# EAGLE design zesilovac (EAGLE 7.2.0)
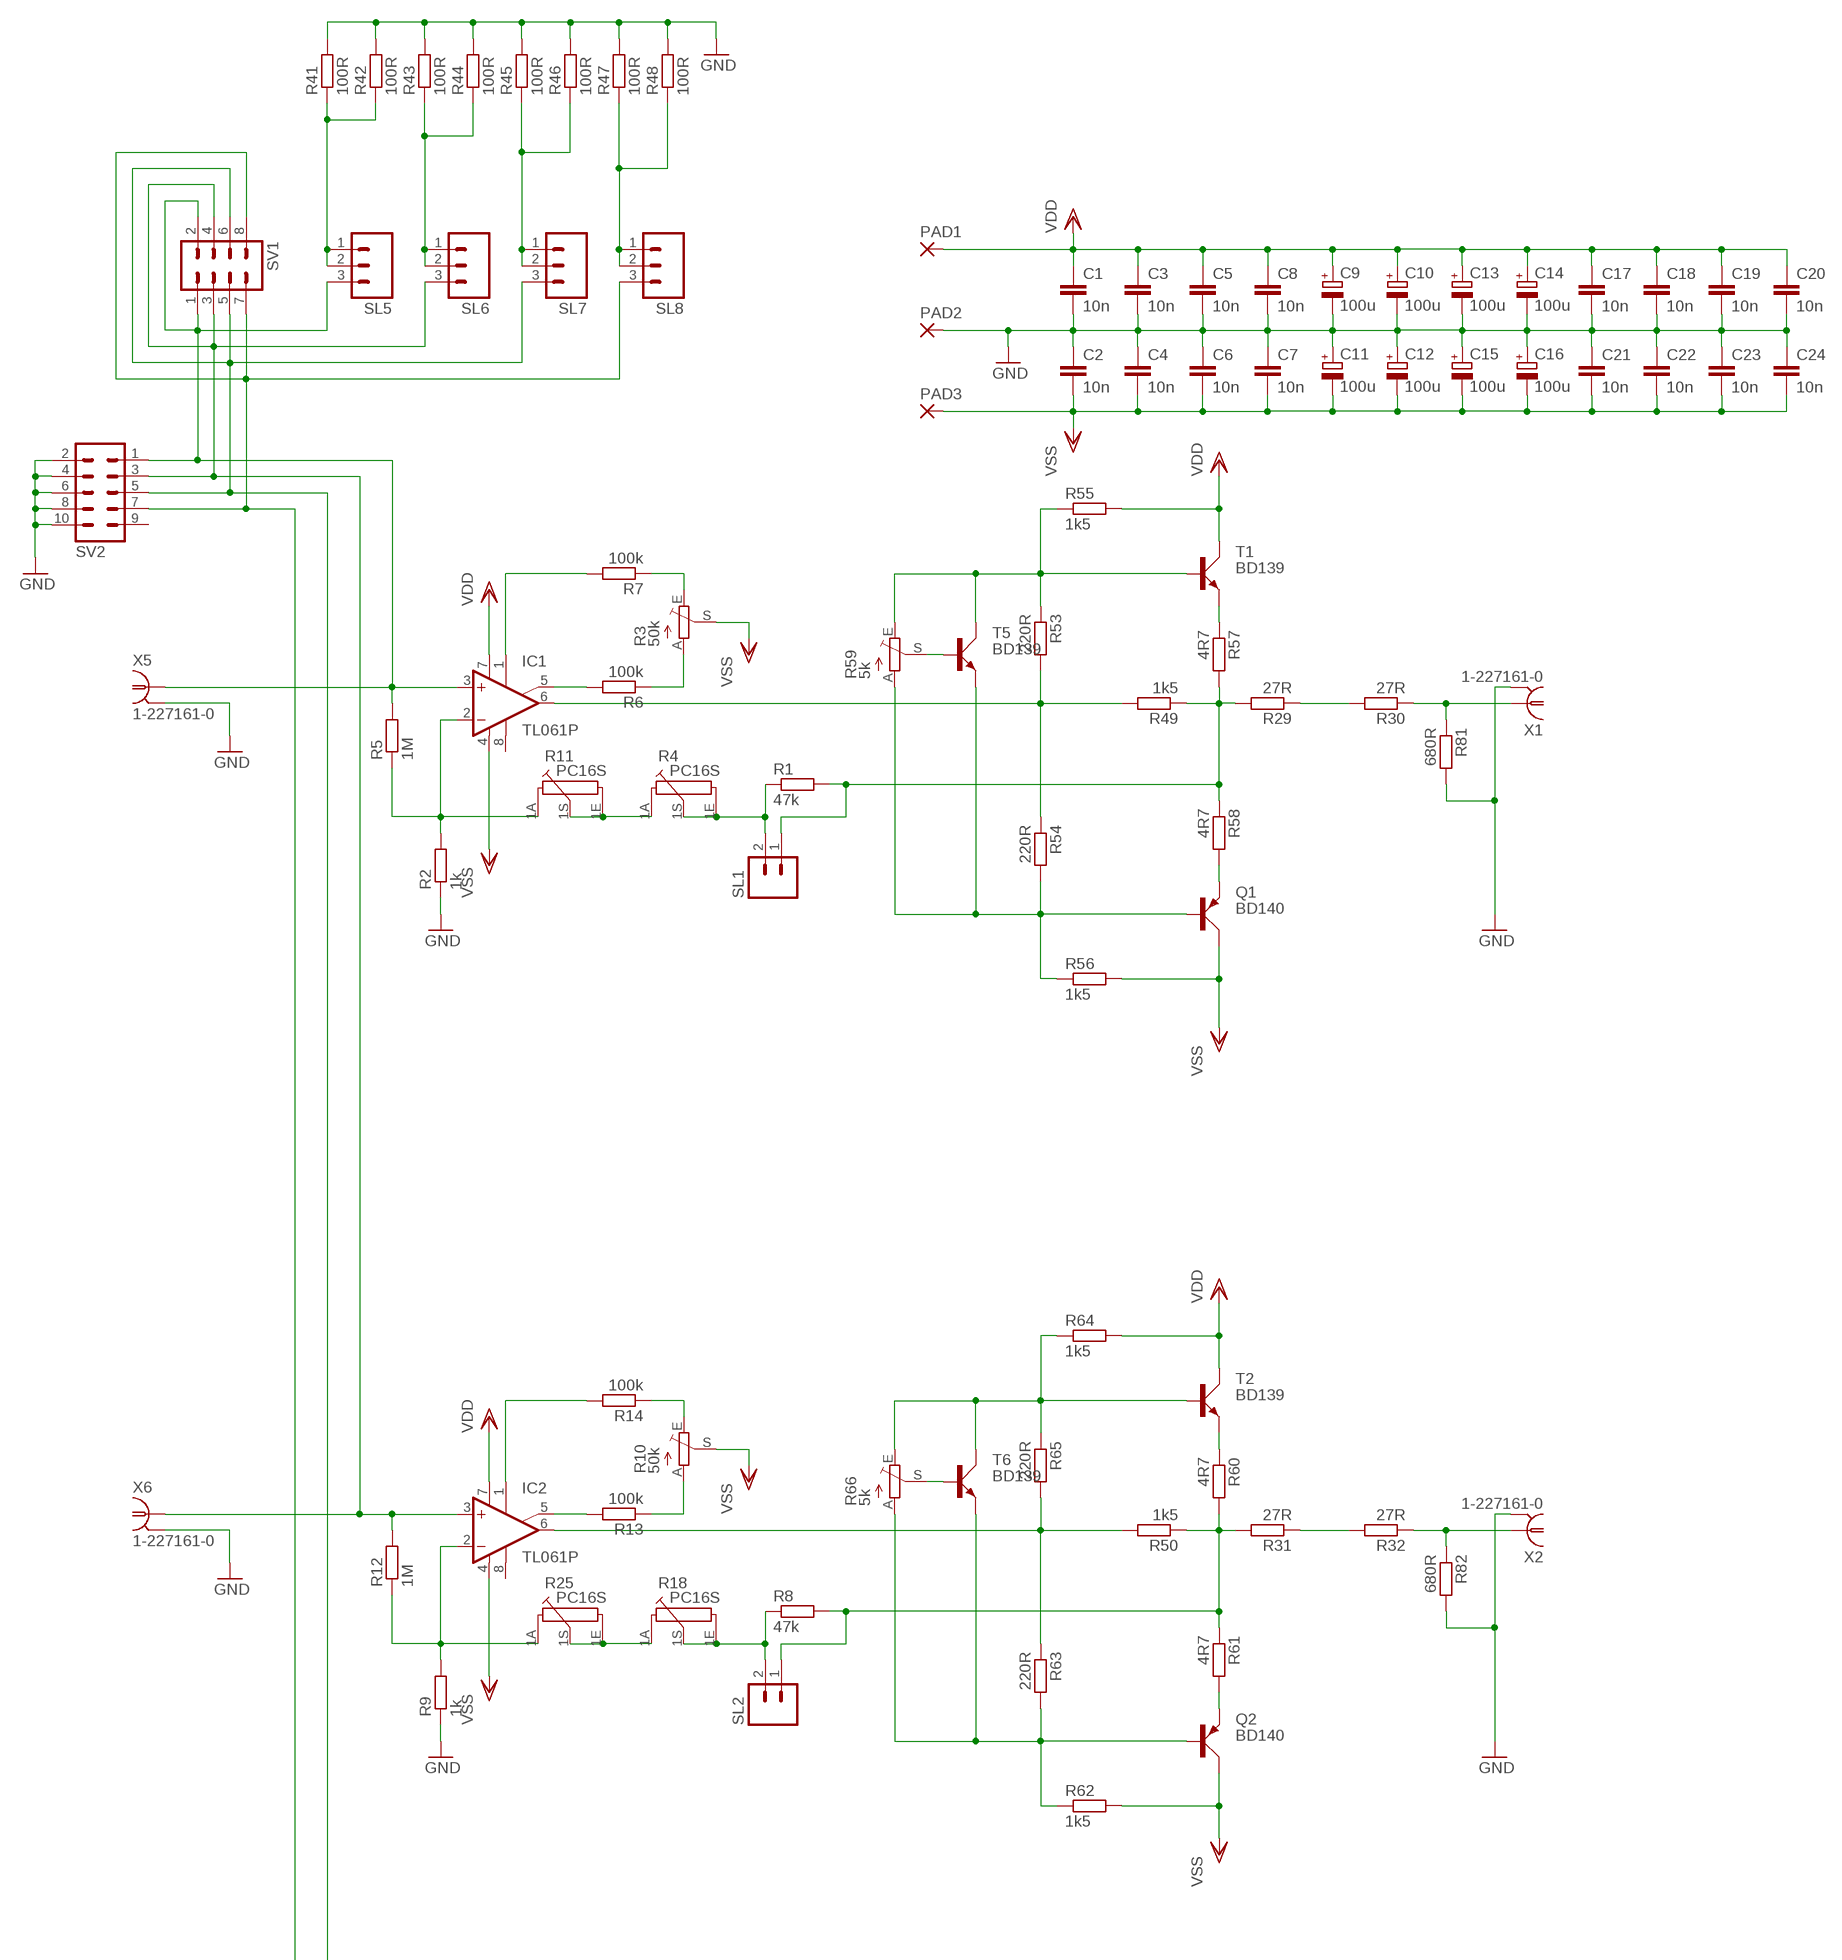
[diagram p0: schematic, sheet 1, part 1 of 2]
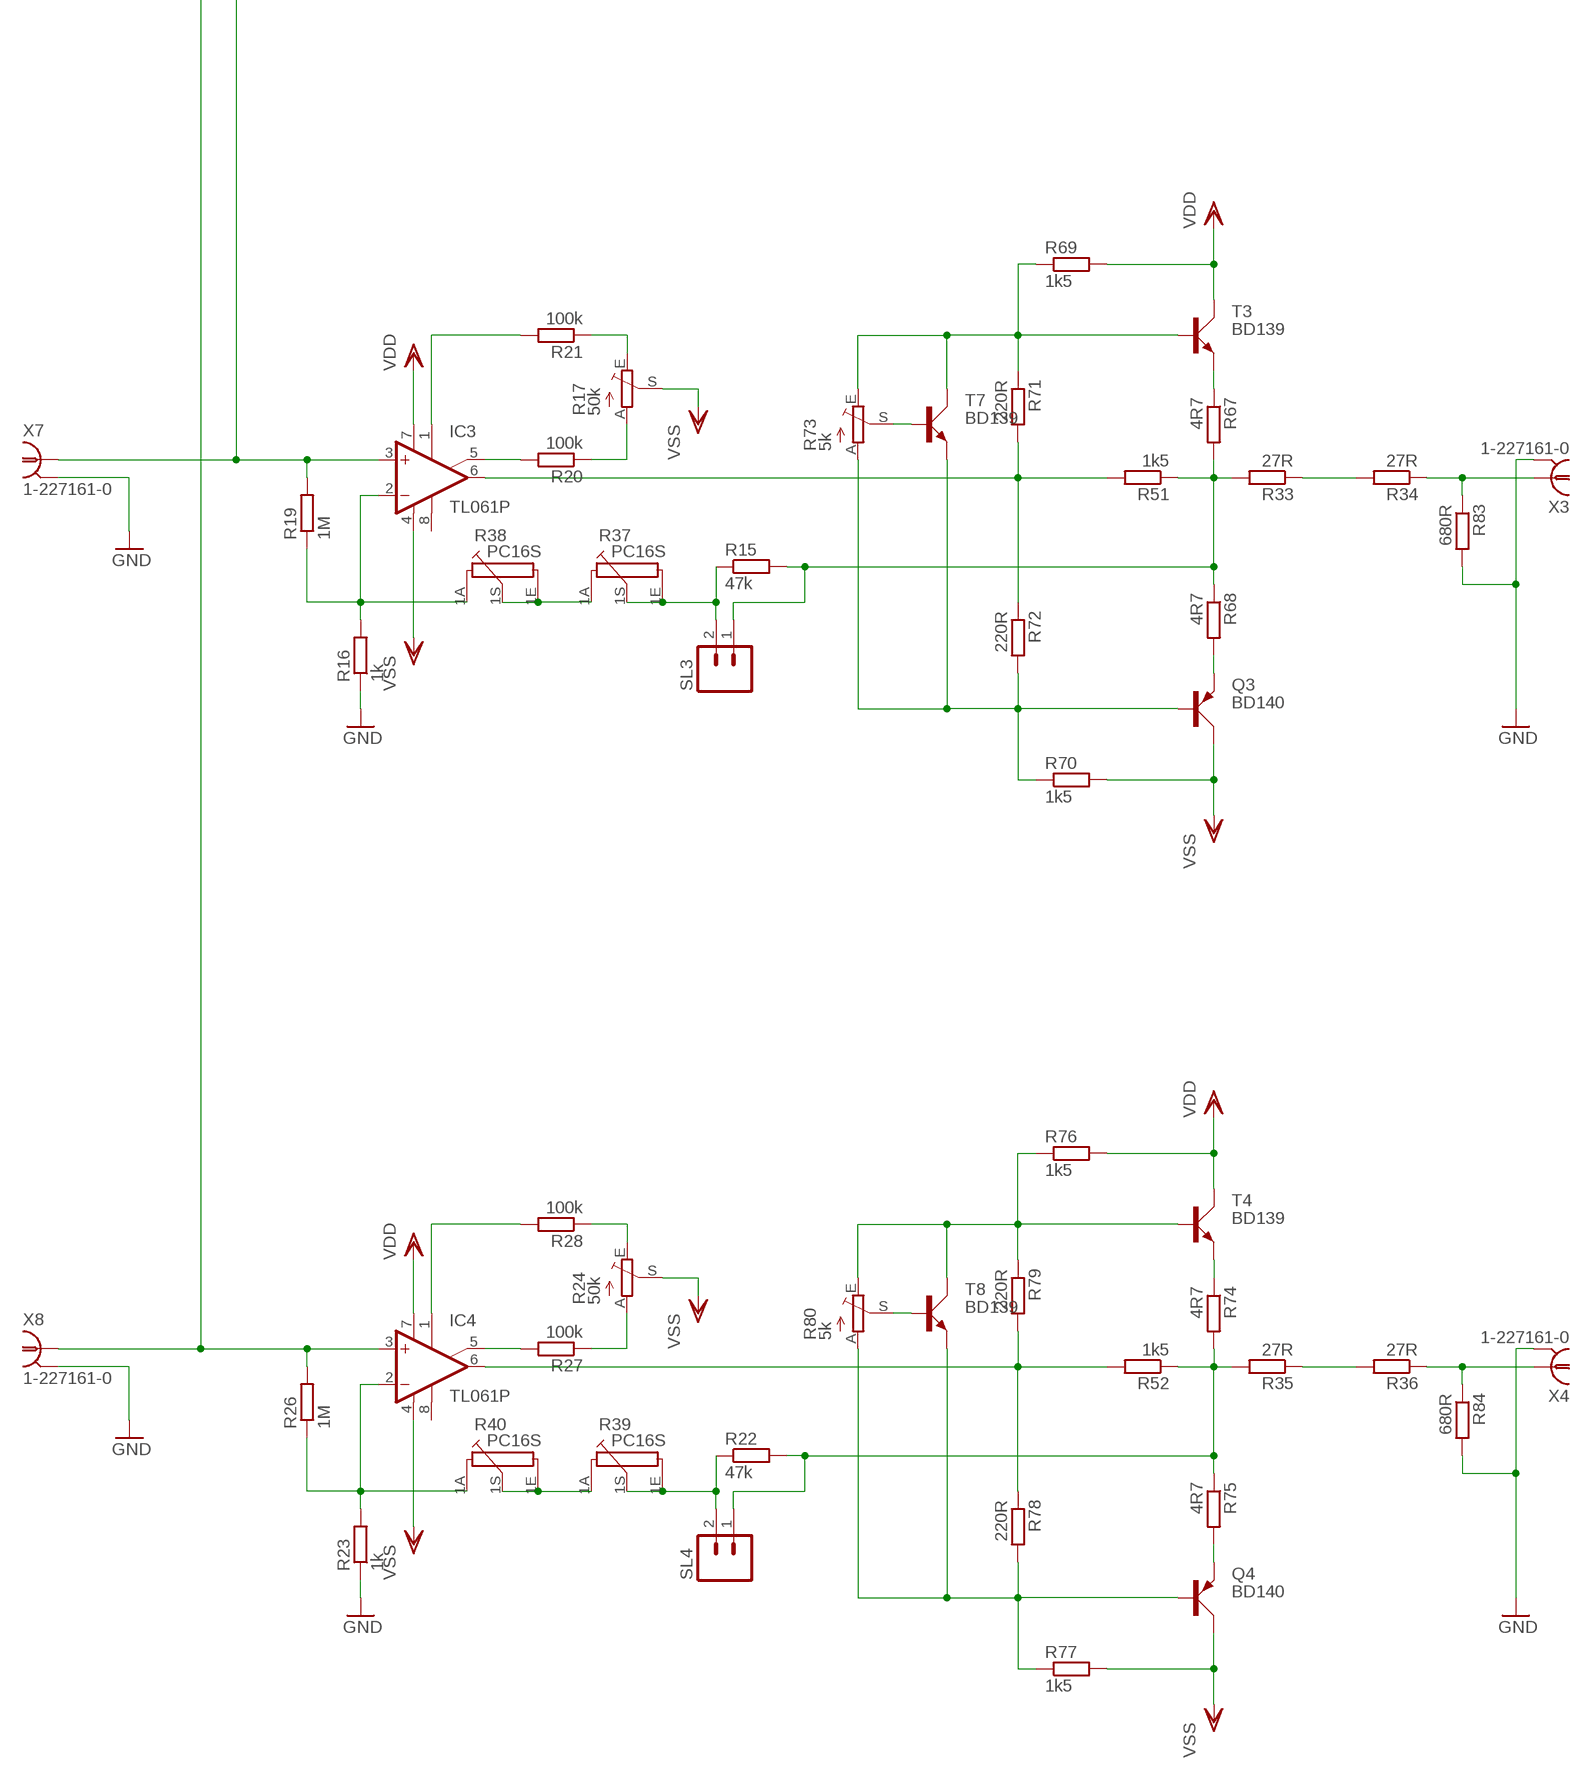
[diagram p1: schematic, sheet 1, part 2 of 2]

## Parts
C1  10n  C5/5  [C5B5]
C2  10n  C5/5  [C5B5]
C3  10n  C5/5  [C5B5]
C4  10n  C5/5  [C5B5]
C5  10n  C5/5  [C5B5]
C6  10n  C5/5  [C5B5]
C7  10n  C5/5  [C5B5]
C8  10n  C5/5  [C5B5]
C9  100u  CPOL-EUE5-13  [E5-13]
C10  100u  CPOL-EUE5-13  [E5-13]
C11  100u  CPOL-EUE5-13  [E5-13]
C12  100u  CPOL-EUE5-13  [E5-13]
C13  100u  CPOL-EUE5-13  [E5-13]
C14  100u  CPOL-EUE5-13  [E5-13]
C15  100u  CPOL-EUE5-13  [E5-13]
C16  100u  CPOL-EUE5-13  [E5-13]
C17  10n  C5/5  [C5B5]
C18  10n  C5/5  [C5B5]
C19  10n  C5/5  [C5B5]
C20  10n  C5/5  [C5B5]
C21  10n  C5/5  [C5B5]
C22  10n  C5/5  [C5B5]
C23  10n  C5/5  [C5B5]
C24  10n  C5/5  [C5B5]
IC1  TL061P  [DIL08]
IC2  TL061P  [DIL08]
IC3  TL061P  [DIL08]
IC4  TL061P  [DIL08]
PAD1  3,81/1,4  [3,81/1,4]
PAD2  3,81/1,4  [3,81/1,4]
PAD3  3,81/1,4  [3,81/1,4]
Q1  BD140  [TO126AV]
Q2  BD140  [TO126AV]
Q3  BD140  [TO126AV]
Q4  BD140  [TO126AV]
R1  47k  R-EU_0207/12  [0207/12]
R2  1k  R-EU_0207/12  [0207/12]
R3  50k  TRIM_EU-LI10  [LI10]
R4  PC16S  [PC16S]
R5  1M  R-EU_0207/12  [0207/12]
R6  100k  R-EU_0207/12  [0207/12]
R7  100k  R-EU_0207/12  [0207/12]
R8  47k  R-EU_0207/12  [0207/12]
R9  1k  R-EU_0207/12  [0207/12]
R10  50k  TRIM_EU-LI10  [LI10]
R11  PC16S  [PC16S]
R12  1M  R-EU_0207/12  [0207/12]
R13  100k  R-EU_0207/12  [0207/12]
R14  100k  R-EU_0207/12  [0207/12]
R15  47k  R-EU_0207/12  [0207/12]
R16  1k  R-EU_0207/12  [0207/12]
R17  50k  TRIM_EU-LI10  [LI10]
R18  PC16S  [PC16S]
R19  1M  R-EU_0207/12  [0207/12]
R20  100k  R-EU_0207/12  [0207/12]
R21  100k  R-EU_0207/12  [0207/12]
R22  47k  R-EU_0207/12  [0207/12]
R23  1k  R-EU_0207/12  [0207/12]
R24  50k  TRIM_EU-LI10  [LI10]
R25  PC16S  [PC16S]
R26  1M  R-EU_0207/12  [0207/12]
R27  100k  R-EU_0207/12  [0207/12]
R28  100k  R-EU_0207/12  [0207/12]
R29  27R  R-EU_0411/12  [0411/12]
R30  27R  R-EU_0411/12  [0411/12]
R31  27R  R-EU_0411/12  [0411/12]
R32  27R  R-EU_0411/12  [0411/12]
R33  27R  R-EU_0411/12  [0411/12]
R34  27R  R-EU_0411/12  [0411/12]
R35  27R  R-EU_0411/12  [0411/12]
R36  27R  R-EU_0411/12  [0411/12]
R37  PC16S  [PC16S]
R38  PC16S  [PC16S]
R39  PC16S  [PC16S]
R40  PC16S  [PC16S]
R41  100R  R-EU_0207/12  [0207/12]
R42  100R  R-EU_0207/12  [0207/12]
R43  100R  R-EU_0207/12  [0207/12]
R44  100R  R-EU_0207/12  [0207/12]
R45  100R  R-EU_0207/12  [0207/12]
R46  100R  R-EU_0207/12  [0207/12]
R47  100R  R-EU_0207/12  [0207/12]
R48  100R  R-EU_0207/12  [0207/12]
R49  1k5  R-EU_0207/12  [0207/12]
R50  1k5  R-EU_0207/12  [0207/12]
R51  1k5  R-EU_0207/12  [0207/12]
R52  1k5  R-EU_0207/12  [0207/12]
R53  220R  R-EU_0207/12  [0207/12]
R54  220R  R-EU_0207/12  [0207/12]
R55  1k5  R-EU_0207/12  [0207/12]
R56  1k5  R-EU_0207/12  [0207/12]
R57  4R7  R-EU_0207/12  [0207/12]
R58  4R7  R-EU_0207/12  [0207/12]
R59  5k  TRIM_EU-LI10  [LI10]
R60  4R7  R-EU_0207/12  [0207/12]
R61  4R7  R-EU_0207/12  [0207/12]
R62  1k5  R-EU_0207/12  [0207/12]
R63  220R  R-EU_0207/12  [0207/12]
R64  1k5  R-EU_0207/12  [0207/12]
R65  220R  R-EU_0207/12  [0207/12]
R66  5k  TRIM_EU-LI10  [LI10]
R67  4R7  R-EU_0207/12  [0207/12]
R68  4R7  R-EU_0207/12  [0207/12]
R69  1k5  R-EU_0207/12  [0207/12]
R70  1k5  R-EU_0207/12  [0207/12]
R71  220R  R-EU_0207/12  [0207/12]
R72  220R  R-EU_0207/12  [0207/12]
R73  5k  TRIM_EU-LI10  [LI10]
R74  4R7  R-EU_0207/12  [0207/12]
R75  4R7  R-EU_0207/12  [0207/12]
R76  1k5  R-EU_0207/12  [0207/12]
R77  1k5  R-EU_0207/12  [0207/12]
R78  220R  R-EU_0207/12  [0207/12]
R79  220R  R-EU_0207/12  [0207/12]
R80  5k  TRIM_EU-LI10  [LI10]
R81  680R  R-EU_0207/12  [0207/12]
R82  680R  R-EU_0207/12  [0207/12]
R83  680R  R-EU_0207/12  [0207/12]
R84  680R  R-EU_0207/12  [0207/12]
SL1  M02  [02P]
SL2  M02  [02P]
SL3  M02  [02P]
SL4  M02  [02P]
SL5  M03  [03P]
SL6  M03  [03P]
SL7  M03  [03P]
SL8  M03  [03P]
SV1  MA04-2  [MA04-2]
SV2  MA05-2  [MA05-2]
T1  BD139  [TO126AV]
T2  BD139  [TO126AV]
T3  BD139  [TO126AV]
T4  BD139  [TO126AV]
T5  BD139  [TO126AV]
T6  BD139  [TO126AV]
T7  BD139  [TO126AV]
T8  BD139  [TO126AV]
X1  1-227161-0  [AMP_227161]
X2  1-227161-0  [AMP_227161]
X3  1-227161-0  [AMP_227161]
X4  1-227161-0  [AMP_227161]
X5  1-227161-0  [AMP_227161]
X6  1-227161-0  [AMP_227161]
X7  1-227161-0  [AMP_227161]
X8  1-227161-0  [AMP_227161]

## Nets
GND: C1.2 C2.1 C3.2 C4.1 C5.2 C6.1 C7.1 C8.2 C9.- C10.- C11.+ C12.+ C13.- C14.- C15.+ C16.+ C17.2 C18.2 C19.2 C20.2 C21.1 C22.1 C23.1 C24.1 PAD2.1(P) R2.1 R9.1 R16.1 R23.1 R41.2 R42.2 R43.2 R44.2 R45.2 R46.2 R47.2 R48.2 R81.2 R82.2 R83.2 R84.2 SV2.2 SV2.4 SV2.6 SV2.8 SV2.10 X1.2 X2.2 X3.2 X4.2 X5.2 X6.2 X7.2 X8.2
N$1: IC1.2(-IN) R2.2 R5.1 R11.1A
N$2: R1.1 R4.1E R4.1S SL1.2
N$3: IC1.6(OUT) R49.2 R53.2 R54.1
N$4: IC1.1(ON1) R7.2
N$5: R3.A R6.1
N$6: IC1.3(+IN) R5.2 SL5.3 SV1.1 SV1.2 SV2.1 X5.1
N$7: R3.E R7.1
N$8: IC1.5(ON2) R6.2
N$9: IC2.2(-IN) R9.2 R12.1 R25.1A
N$10: R22.2 R35.2 R52.1 R74.2 R75.1 SL4.1
N$11: IC2.1(ON1) R14.2
N$12: R10.A R13.1
N$13: R4.1A R11.1E R11.1S
N$14: IC2.3(+IN) R12.2 SL6.3 SV1.3 SV1.4 SV2.3 X6.1
N$15: R10.E R14.1
N$16: IC2.5(ON2) R13.2
N$17: IC3.2(-IN) R16.2 R19.1 R38.1A
N$18: R15.2 R33.2 R51.1 R67.2 R68.1 SL3.1
N$19: IC3.1(ON1) R21.2
N$20: R17.A R20.1
N$21: R15.1 R37.1E R37.1S SL3.2
N$22: IC3.3(+IN) R19.2 SL7.3 SV1.5 SV1.6 SV2.5 X7.1
N$23: R17.E R21.1
N$24: IC3.5(ON2) R20.2
N$25: IC4.2(-IN) R23.2 R26.1 R40.1A
N$26: R8.2 R31.2 R50.1 R60.2 R61.1 SL2.1
N$27: IC4.1(ON1) R28.2
N$28: R24.A R27.1
N$29: R22.1 R39.1E R39.1S SL4.2
N$30: IC4.3(+IN) R26.2 SL8.3 SV1.7 SV1.8 SV2.7 X8.1
N$31: R24.E R28.1
N$32: IC4.5(ON2) R27.2
N$33: R8.1 R18.1E R18.1S SL2.2
N$34: R18.1A R25.1E R25.1S
N$35: R37.1A R38.1E R38.1S
N$36: R29.1 R30.2
N$37: R31.1 R32.2
N$38: R35.1 R36.2
N$39: R36.1 R84.1 X4.1
N$40: R39.1A R40.1E R40.1S
N$41: Q1.B R54.2 R56.1 R59.A T5.E
N$42: R43.1 R44.1 SL6.1 SL6.2
N$43: R45.1 R46.1 SL7.1 SL7.2
N$44: R47.1 R48.1 SL8.1 SL8.2
N$45: IC2.6(OUT) R50.2 R63.1 R65.2
N$46: R1.2 R29.2 R49.1 R57.2 R58.1 SL1.1
N$47: R41.1 R42.1 SL5.1 SL5.2
N$48: IC3.6(OUT) R51.2 R71.2 R72.1
N$49: R53.1 R55.1 R59.E T1.B T5.C
N$50: IC4.6(OUT) R52.2 R78.1 R79.2
N$51: R57.1 T1.E
N$52: Q1.E R58.2
N$53: R59.S T5.B
N$54: R67.1 T3.E
N$55: Q2.E R61.2
N$56: Q3.E R68.2
N$57: R60.1 T2.E
N$58: Q2.B R62.1 R63.2 R66.A T6.E
N$59: R64.1 R65.1 R66.E T2.B T6.C
N$60: R66.S T6.B
N$61: R69.1 R71.1 R73.E T3.B T7.C
N$62: Q3.B R70.1 R72.2 R73.A T7.E
N$63: R74.1 T4.E
N$64: Q4.E R75.2
N$65: R73.S T7.B
N$66: R30.1 R81.1 X1.1
N$67: R32.1 R82.1 X2.1
N$68: R76.1 R79.1 R80.E T4.B T8.C
N$69: Q4.B R77.1 R78.2 R80.A T8.E
N$70: R80.S T8.B
N$72: R33.1 R34.2
N$73: R34.1 R83.1 X3.1
VDD: C1.1 C3.1 C5.1 C8.1 C9.+ C10.+ C13.+ C14.+ C17.1 C18.1 C19.1 C20.1 IC1.7(V+) IC2.7(V+) IC3.7(V+) IC4.7(V+) PAD1.1(P) R55.2 R64.2 R69.2 R76.2 T1.C T2.C T3.C T4.C
VSS: C2.2 C4.2 C6.2 C7.2 C11.- C12.- C15.- C16.- C21.2 C22.2 C23.2 C24.2 IC1.4(V-) IC2.4(V-) IC3.4(V-) IC4.4(V-) PAD3.1(P) Q1.C Q2.C Q3.C Q4.C R3.S R10.S R17.S R24.S R56.2 R62.2 R70.2 R77.2
Unconnected: IC1.8(OPT) IC2.8(OPT) IC3.8(OPT) IC4.8(OPT) SV2.9

## Library data of the parts
C1-C8 C17-C24 = capacitor-wima:C: CAPACITOR naming: grid - package width
C9-C16 = rcl:CPOL-EU: POLARIZED CAPACITOR, European symbol
IC1-IC4 = linear:TL061: OP AMP
PAD1-PAD3 = wirepad:3,81/1,4: THROUGH-HOLE PAD
Q1-Q4 = transistor-power:BD140: PNP TRANSISTOR
R1 R2 R5-R9 R12-R16 R19-R23 R26-R36 R41-R58 R60-R65 R67-R72 R74-R79 R81-R84 = resistor:R-EU_: RESISTOR, European symbol
R3 R10 R17 R24 R59 R66 R73 R80 = pot:TRIM_EU-: POTENTIOMETER
R4 R11 R18 R25 R37-R40 = piher:PC16S: POTENTIOMETER single carbon potentiometer, 16 mm, S3ROH; OC_FARNELL: 4452940; OC_NEWARK: unknown
SL1-SL4 = con-amp-quick:M02: AMP QUICK CONNECTOR; OC_FARNELL: unknown; OC_NEWARK: unknown
SL5-SL8 = con-amp-quick:M03: AMP QUICK CONNECTOR; OC_FARNELL: unknown; OC_NEWARK: unknown
SV1 = con-lstb:MA04-2: PIN HEADER; OC_FARNELL: unknown; OC_NEWARK: unknown
SV2 = con-lstb:MA05-2: PIN HEADER; OC_FARNELL: unknown; OC_NEWARK: unknown
T1-T8 = transistor-power:BD139: NPN TRANSISTOR
X1-X8 = con-coax:?227161*: JACK, RIGHT ANGLE, 50 OHM, PCB, BNC Source: amp_227161.pdf; MF: TYCO ELECTRONICS; MPN: 1-227161; OC_FARNELL: unknown; OC_NEWARK: 33B3200

## Board
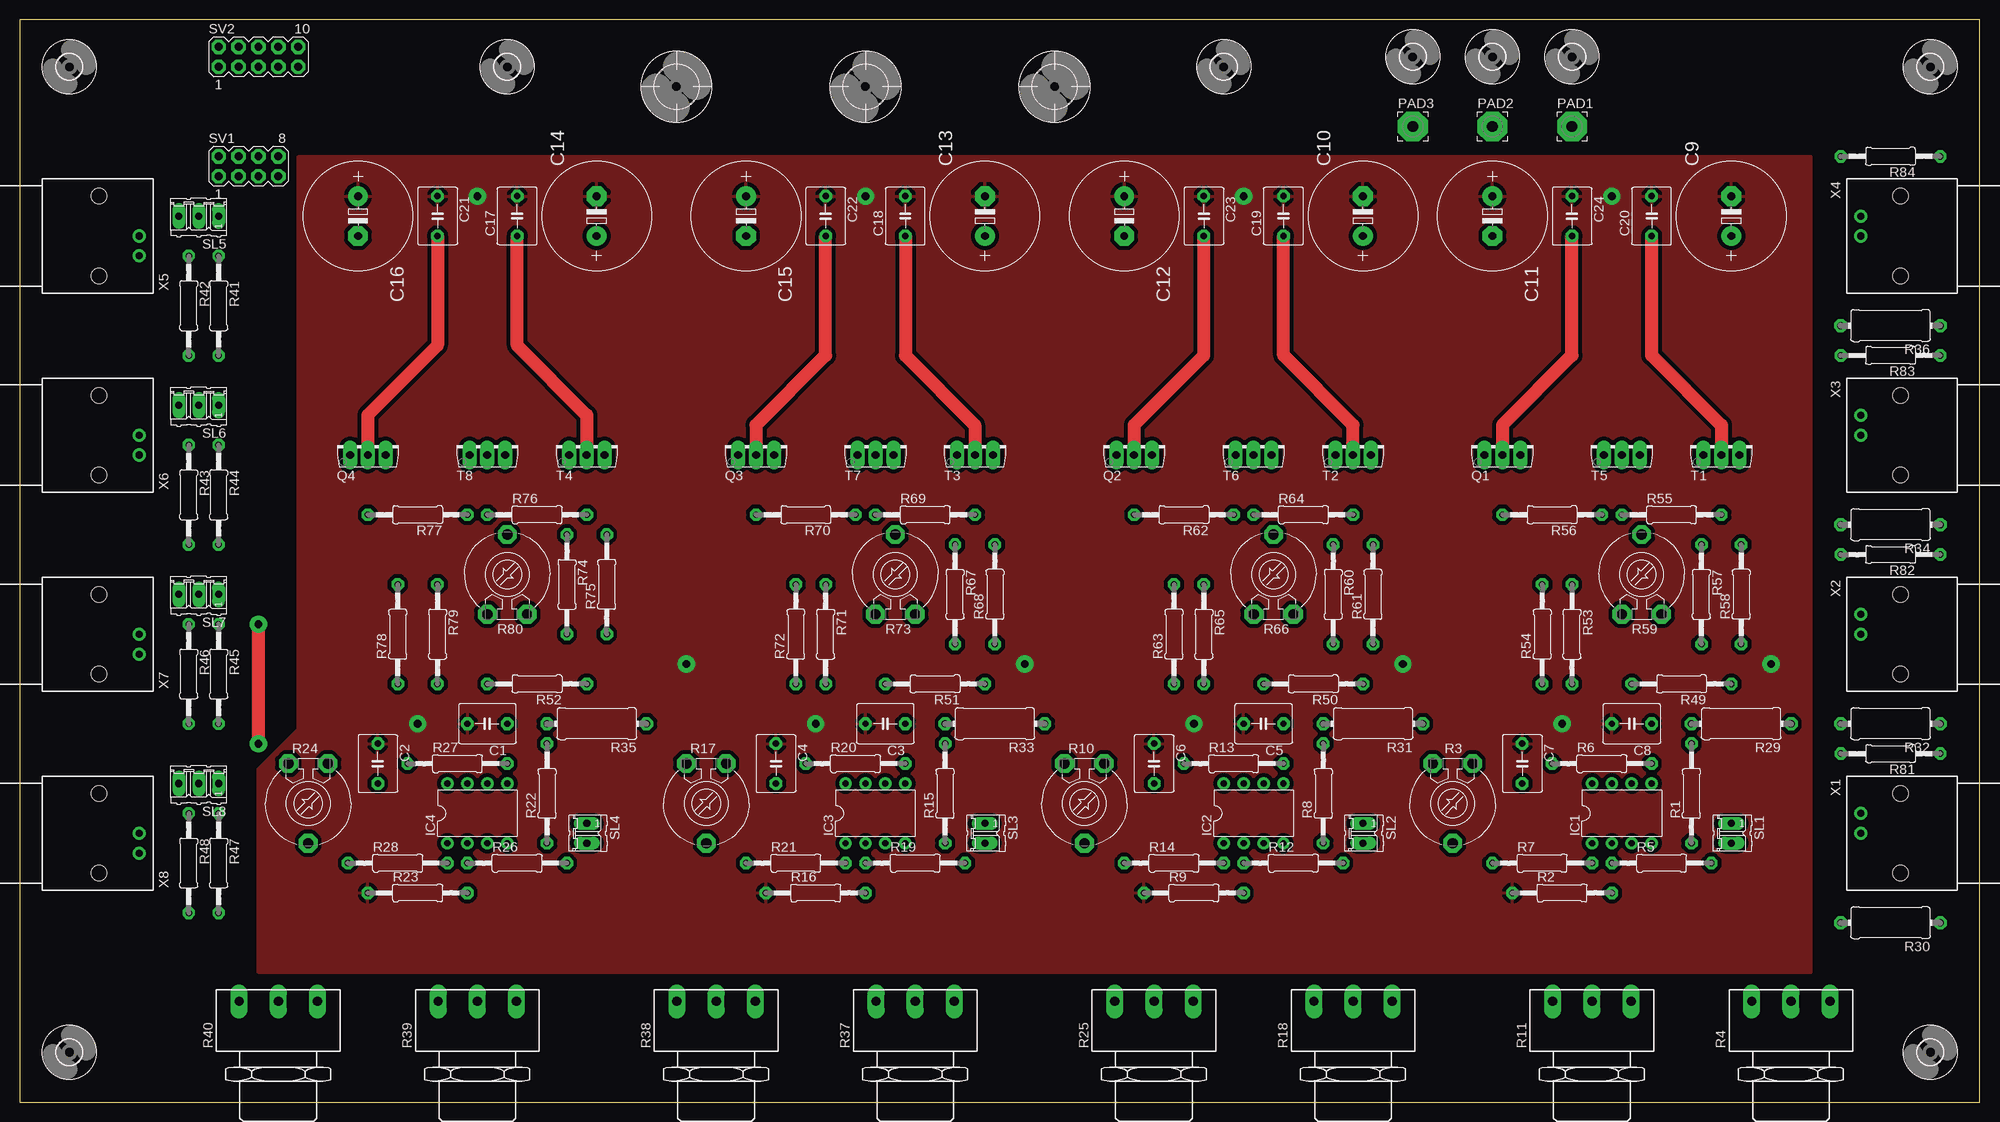
[diagram p2: board, top side]
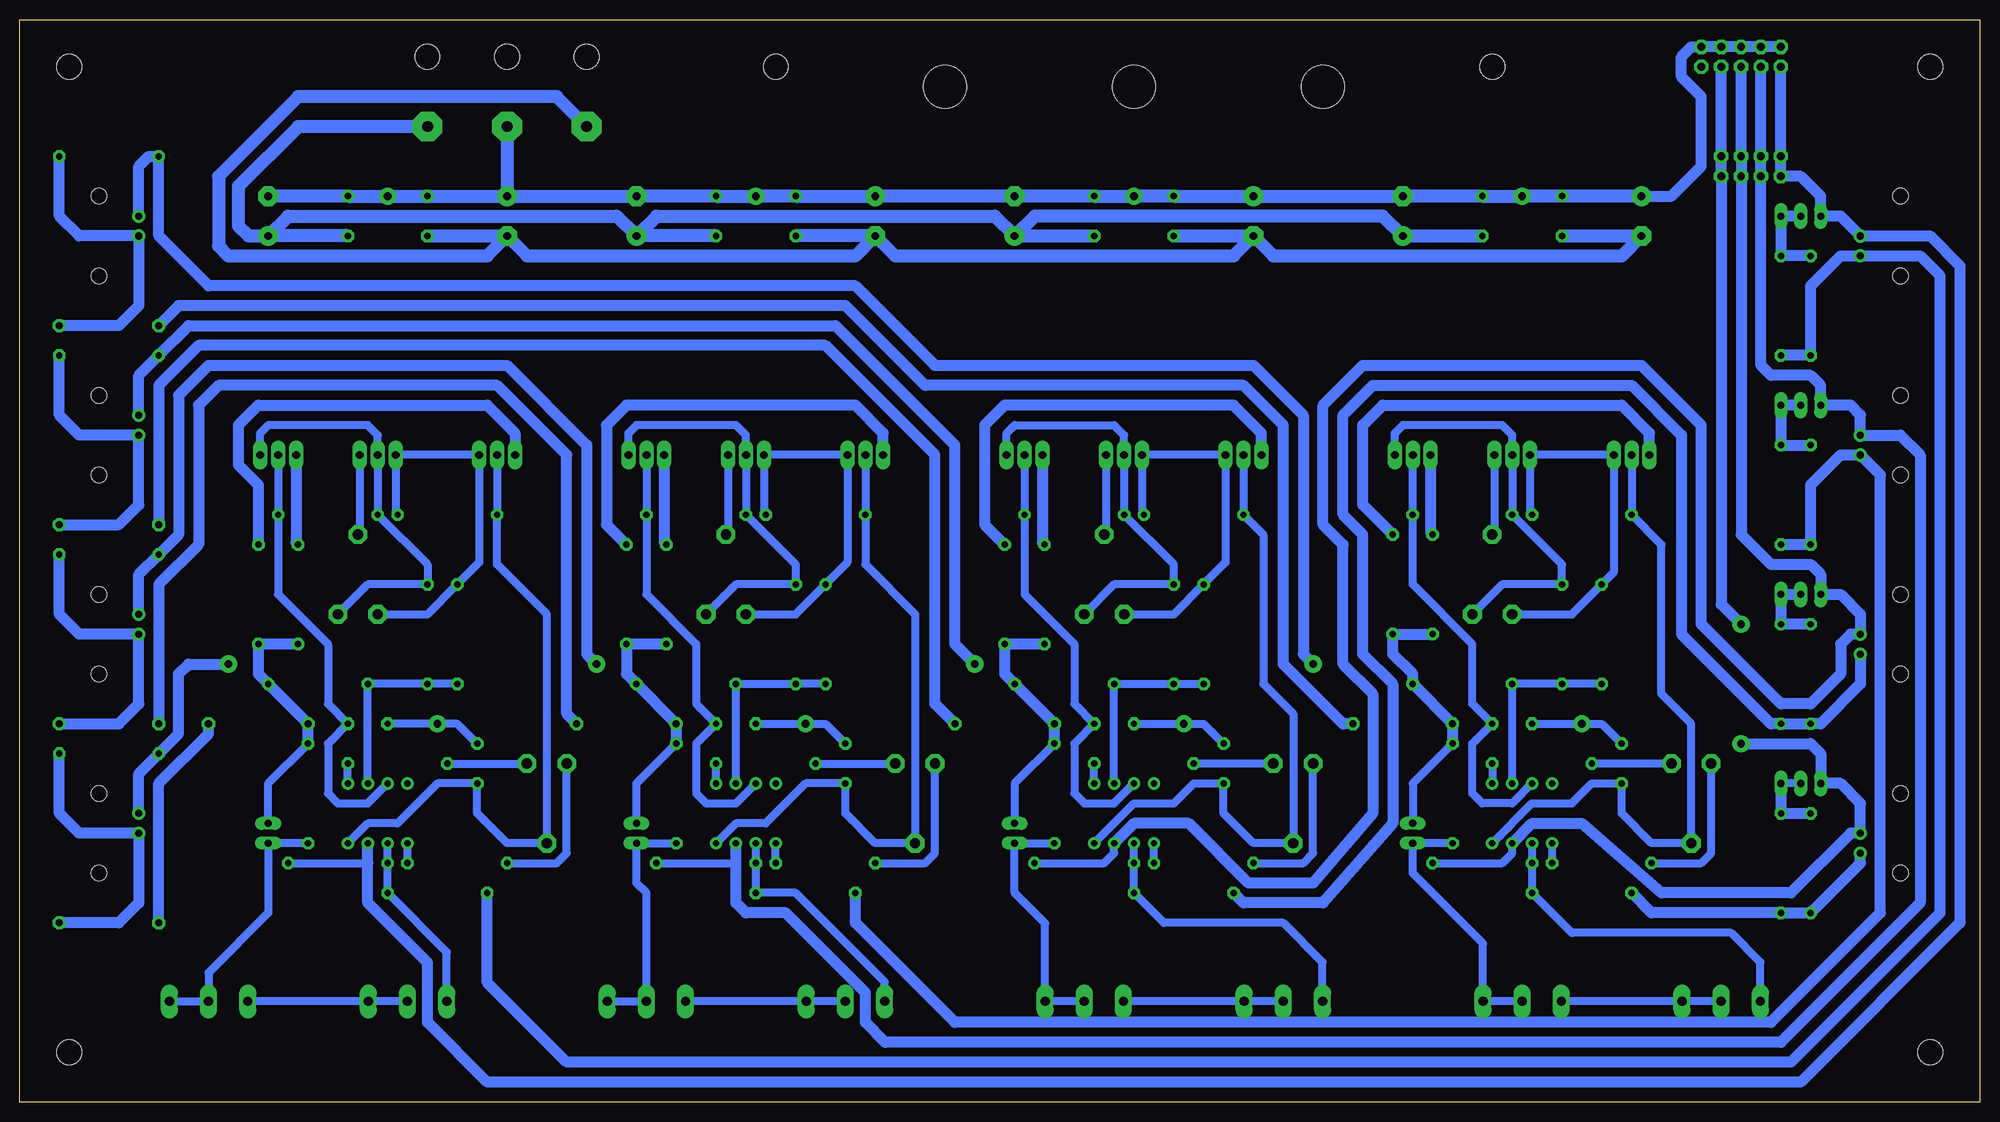
[diagram p3: board, bottom side, seen from below]

Size 250.17 x 138.1 mm. Coordinates in mm from the lower left corner, seen from the top.
Outline: 0,0 250.17,0 250.17,138.1 0,138.1 0,0
Copper layers (1*16): Top 0.035mm / dielectric 1.5mm / Bottom 0.035mm
Design rules "default *": minimum track width 10mil, minimum drill 24mil, track to track 20mil, track to pad 20mil, pad to pad 20mil, via to via 20mil, smd to smd 8mil, copper to edge 40mil, drill to drill 8mil, minimum pad ring 15mil, minimum via ring 8mil, stop-mask expansion 4mil, vias tented up to drill 0mil, thermal gap 20mil

### Footprints (pad centres in the part's own frame; a part is rotated, then mirrored left to right if it is on the bottom)
C5B5 = drill 0.813 pad 1.6 octagon: 1 -2.54,0; 2 2.54,0
E5-13 = drill 1.016 pad 2.54: + -2.54,0 | drill 1.016 pad 2.54 octagon: - 2.54,0
DIL08 = drill 0.813 pad 1.27: 1 -3.81,-3.81; 2 -1.27,-3.81; 3 1.27,-3.81; 4 3.81,-3.81; 5 3.81,3.81; 6 1.27,3.81; 7 -1.27,3.81; 8 -3.81,3.81
3,81/1,4 = drill 1.397 pad 3.81 octagon: 1 0,0
TO126AV = drill 1.016 long: B 2.286,-1.27; C 0,-1.27; E -2.286,-1.27
0207/12 = drill 0.813 octagon: 1 -6.35,0; 2 6.35,0
LI10 = drill 1.321 octagon: A -2.54,-5.08; E 2.54,-5.08; S 0,5.08
PC16S = drill 1.2 long: 1A -5,6.5; 1E 5,6.5; 1S 0,6.5
0411/12 = drill 0.914 octagon: 1 -6.35,0; 2 6.35,0
02P = drill 0.914 long: 1 -1.27,0; 2 1.27,0
03P = drill 0.914 long: 1 -2.54,0; 2 0,0; 3 2.54,0
MA04-2 = drill 1.016 octagon: 1 -3.81,-1.27; 2 -3.81,1.27; 3 -1.27,-1.27; 4 -1.27,1.27; 5 1.27,-1.27; 6 1.27,1.27; 7 3.81,-1.27; 8 3.81,1.27
MA05-2 = drill 1.016 octagon: 1 -5.08,-1.27; 2 -5.08,1.27; 3 -2.54,-1.27; 4 -2.54,1.27; 5 0,-1.27; 6 0,1.27; 7 2.54,-1.27; 8 2.54,1.27; 9 5.08,-1.27; 10 5.08,1.27
3,2 = hole 3.2: 0,0
5,5 = hole 5.5: 0,0
AMP_227161 = drill 0.9 pad 1.27: 1 0,-5.08; 2 -2.54,-5.08 | hole 2: -5.08,0; 5.08,0

### Placement (x,y rotation side)
C1  59.69,48.26 180 top
C2  45.72,43.18 270 top
C3  110.49,48.26 180 top
C4  96.52,43.18 270 top
C5  158.75,48.26 180 top
C6  144.78,43.18 270 top
C7  191.77,43.18 270 top
C8  205.74,48.26 180 top
C9  218.44,113.03 90 top
C10  171.45,113.03 90 top
C11  187.96,113.03 270 top
C12  140.97,113.03 270 top
C13  123.19,113.03 90 top
C14  73.66,113.03 90 top
C15  92.71,113.03 270 top
C16  43.18,113.03 270 top
C17  63.5,113.03 90 top
C18  113.03,113.03 90 top
C19  161.29,113.03 90 top
C20  208.28,113.03 90 top
C21  53.34,113.03 270 top
C22  102.87,113.03 270 top
C23  151.13,113.03 270 top
C24  198.12,113.03 270 top
IC1  204.47,36.83 0 top
IC2  157.48,36.83 0 top
IC3  109.22,36.83 0 top
IC4  58.42,36.83 0 top
PAD1  198.12,124.46 0 top
PAD2  187.96,124.46 0 top
PAD3  177.8,124.46 0 top
Q1  189.23,83.82 0 top
Q2  142.24,83.82 0 top
Q3  93.98,83.82 0 top
Q4  44.45,83.82 0 top
R1  213.36,39.37 90 top
R2  196.85,26.67 0 top
R3  182.88,38.1 180 top
R4  226.06,6.35 0 top
R5  209.55,30.48 0 top
R6  201.93,43.18 0 top
R7  194.31,30.48 0 top
R8  166.37,39.37 90 top
R9  149.86,26.67 0 top
R10  135.89,38.1 180 top
R11  200.66,6.35 0 top
R12  162.56,30.48 0 top
R13  154.94,43.18 0 top
R14  147.32,30.48 0 top
R15  118.11,39.37 90 top
R16  101.6,26.67 0 top
R17  87.63,38.1 180 top
R18  170.18,6.35 0 top
R19  114.3,30.48 0 top
R20  106.68,43.18 0 top
R21  99.06,30.48 0 top
R22  67.31,39.37 90 top
R23  50.8,26.67 0 top
R24  36.83,38.1 180 top
R25  144.78,6.35 0 top
R26  63.5,30.48 0 top
R27  55.88,43.18 0 top
R28  48.26,30.48 0 top
R29  219.71,48.26 180 top
R30  238.76,22.86 180 top
R31  172.72,48.26 180 top
R32  238.76,48.26 180 top
R33  124.46,48.26 180 top
R34  238.76,73.66 180 top
R35  73.66,48.26 180 top
R36  238.76,99.06 180 top
R37  114.3,6.35 0 top
R38  88.9,6.35 0 top
R39  58.42,6.35 0 top
R40  33.02,6.35 0 top
R41  25.4,101.6 270 top
R42  21.59,101.6 270 top
R43  21.59,77.47 270 top
R44  25.4,77.47 270 top
R45  25.4,54.61 270 top
R46  21.59,54.61 270 top
R47  25.4,30.48 270 top
R48  21.59,30.48 270 top
R49  212.09,53.34 180 top
R50  165.1,53.34 180 top
R51  116.84,53.34 180 top
R52  66.04,53.34 180 top
R53  198.12,59.69 270 top
R54  194.31,59.69 90 top
R55  210.82,74.93 0 top
R56  195.58,74.93 180 top
R57  214.63,64.77 270 top
R58  219.71,64.77 90 top
R59  207.01,67.31 0 top
R60  167.64,64.77 270 top
R61  172.72,64.77 90 top
R62  148.59,74.93 180 top
R63  147.32,59.69 90 top
R64  163.83,74.93 0 top
R65  151.13,59.69 270 top
R66  160.02,67.31 0 top
R67  119.38,64.77 270 top
R68  124.46,64.77 90 top
R69  115.57,74.93 0 top
R70  100.33,74.93 180 top
R71  102.87,59.69 270 top
R72  99.06,59.69 90 top
R73  111.76,67.31 0 top
R74  69.85,66.04 270 top
R75  74.93,66.04 90 top
R76  66.04,74.93 0 top
R77  50.8,74.93 180 top
R78  48.26,59.69 90 top
R79  53.34,59.69 270 top
R80  62.23,67.31 0 top
R81  238.76,44.45 180 top
R82  238.76,69.85 180 top
R83  238.76,95.25 180 top
R84  238.76,120.65 180 top
SL1  218.44,34.29 270 top
SL2  171.45,34.29 270 top
SL3  123.19,34.29 270 top
SL4  72.39,34.29 270 top
SL5  22.86,113.03 180 top
SL6  22.86,88.9 180 top
SL7  22.86,64.77 180 top
SL8  22.86,40.64 180 top
SV1  29.21,119.38 0 top
SV2  30.48,133.35 0 top
T1  217.17,83.82 0 top
T2  170.18,83.82 0 top
T3  121.92,83.82 0 top
T4  72.39,83.82 0 top
T5  204.47,83.82 0 top
T6  157.48,83.82 0 top
T7  109.22,83.82 0 top
T8  59.69,83.82 0 top
U$1  [3,2]  6.35,6.35 0 top
U$2  [3,2]  6.35,132.08 0 top
U$3  [3,2]  243.84,132.08 0 top
U$4  [3,2]  243.84,6.35 0 top
U$5  [5,5]  107.95,129.54 0 top
U$6  [5,5]  83.82,129.54 0 top
U$7  [5,5]  132.08,129.54 0 top
U$8  [3,2]  62.23,132.08 0 top
U$9  [3,2]  153.67,132.08 0 top
U$10  [3,2]  177.8,133.35 0 top
U$11  [3,2]  187.96,133.35 0 top
U$12  [3,2]  198.12,133.35 0 top
X1  240.03,34.29 270 top
X2  240.03,59.69 270 top
X3  240.03,85.09 270 top
X4  240.03,110.49 270 top
X5  10.16,110.49 90 top
X6  10.16,85.09 90 top
X7  10.16,59.69 90 top
X8  10.16,34.29 90 top

### Tracks (layer width: path | path; a pad name or v marks a point on that pad's centre or on a via)
GND  (via drill 1 pad 2.18)
  Bottom 1.016: C1.2 v50.8,48.26 48.26,48.26 C2.1 | C7.1 194.31,48.26 v196.85,48.26 C8.2 | C5.2 v149.86,48.26 147.32,48.26 C6.1 | C3.2 v101.6,48.26 99.06,48.26 C4.1
  Bottom 1.422: R41.2 R42.2 21.59,104.14 17.78,107.95 X5.2 7.62,107.95 5.08,105.41 5.08,24.13 24.13,5.08 180.34,5.08 190.5,15.24 R2.1 | R16.1 93.98,25.4 83.82,25.4 74.93,35.56 74.93,53.34 78.74,57.15 78.74,72.39 81.28,74.93 81.28,87.63 77.47,91.44 44.45,91.44 38.1,85.09 38.1,59.69 26.67,48.26 R45.2 R46.2 20.32,48.26 15.24,53.34 X7.2 | v176.53,55.88 177.8,57.15 177.8,83.82 187.96,93.98 226.06,93.98 229.87,90.17 229.87,72.39 R82.2 234.95,67.31 X2.2 | v128.27,55.88 130.81,58.42 130.81,83.82 146.05,99.06 228.6,99.06 R83.2 234.95,92.71 X3.2 | v85.09,55.88 86.36,57.15 86.36,87.63 92.71,93.98 133.35,93.98 143.51,104.14 226.06,104.14 232.41,110.49 R84.2 233.68,120.65 234.95,119.38 X4.2 | R23.1 41.91,24.13 R47.2 R48.2 15.24,30.48 X8.2 | R44.2 R43.2 21.59,78.74 17.78,82.55 X6.2 12.7,80.01 12.7,24.13 26.67,10.16 130.81,10.16 143.51,22.86 R9.1 | SV2.2 SV2.4 SV2.6 SV2.8 SV2.10 36.83,134.62 38.1,133.35 38.1,130.81 35.56,128.27 35.56,119.38 39.37,115.57 C16.+ | X1.2 234.95,41.91 R81.2 229.87,46.99 229.87,54.61 228.6,55.88 v223.52,55.88
  Bottom 1.676: C11.+ C10.- C19.2 v156.21,115.57 C23.1 C12.+ C13.- C18.2 v107.95,115.57 C22.1 C15.+ C14.- C17.2 v58.42,115.57 C21.1 C16.+ | PAD2.1 C11.+ | C11.+ C24.1 v203.2,115.57 C20.2 C9.-
  pour Top: 35.56,120.65 228.6,120.65 228.6,16.51 30.48,16.51 30.48,42.55 35.56,47.62
N$1
  Bottom 1.016: IC1.2 R5.1 R2.2 195.66,19.13 R11.1A
N$2
  Bottom 1.016: R1.1 SL1.2 218.44,24.13 226.06,16.51 R4.1S R4.1E
N$3
  Bottom 1.016: IC1.6 R49.2 R53.2 R54.1
N$4
  Bottom 1.016: R7.2 IC1.1
N$5
  Bottom 1.016: R6.1 R3.A
N$6
  Bottom 1.016: R5.2 205.74,30.48
  Bottom 1.422: IC1.3 205.74,30.48 205.74,25.4 198.12,17.78 198.12,10.16 190.5,2.54 22.86,2.54 2.54,22.86 2.54,106.68 6.35,110.49 X5.1 17.78,113.03 SL5.3 20.32,115.57 22.86,118.11 SV1.1 SV1.2 SV2.1
N$7
  Bottom 1.016: R7.1 181.61,30.48 180.34,31.75 R3.E
N$8
  Bottom 1.016: IC1.5 R6.2
N$9
  Bottom 1.016: IC2.2 R12.1 R9.2 151.13,26.67 139.78,15.32 R25.1A
N$10
  Bottom 1.016: R22.2 72.39,40.64 SL4.1
  Bottom 1.422: R74.2 R75.1 74.93,57.15 72.39,54.61 R52.1 R35.2 R22.2
N$11
  Bottom 1.016: R14.2 IC2.1
N$12
  Bottom 1.016: R13.1 R10.A
N$13
  Bottom 1.016: R11.1S R11.1E R4.1A
N$14
  Bottom 1.016: R12.2 158.75,30.48
  Bottom 1.422: IC2.3 158.75,30.48 158.75,25.4 157.48,24.13 152.4,24.13 142.24,13.97 142.24,10.16 139.7,7.62 25.4,7.62 7.62,25.4 7.62,82.55 10.16,85.09 X6.1 15.24,87.63 16.51,88.9 SL6.3 20.32,91.44 21.59,92.71 26.67,92.71 27.94,93.98 SV1.3 SV1.4 SV2.3
N$15
  Bottom 1.016: R14.1 134.62,30.48 133.35,31.75 R10.E
N$16
  Bottom 1.016: IC2.5 R13.2
N$17
  Bottom 1.016: IC3.2 R19.1 R16.2 104.14,22.86 88.9,22.86 83.9,17.86 R38.1A
N$18
  Bottom 1.016: R15.2 123.19,40.64 SL3.1
  Bottom 1.422: R15.2 R33.2 R51.1 124.46,54.61 R68.1 R67.2
N$19
  Bottom 1.016: R21.2 IC3.1
N$20
  Bottom 1.016: R17.A R20.1
N$21
  Bottom 1.016: R15.1 SL3.2 123.19,26.67 119.3,22.78 R37.1E R37.1S
N$22
  Bottom 1.016: R19.2 111.76,30.48 110.49,31.75 IC3.3
  Bottom 1.422: IC3.3 107.95,35.56 100.97,35.56 93.34,27.94 85.09,27.94 77.47,36.83 77.47,52.07 81.28,55.88 81.28,71.12 83.82,73.66 83.82,88.9 78.74,93.98 43.18,93.98 35.56,86.36 35.56,60.96 25.4,50.8 21.59,50.8 17.78,54.61 17.78,58.42 16.51,59.69 X7.1 15.24,62.23 17.78,64.77 SL7.3 20.32,67.31 21.59,68.58 26.67,68.58 30.48,72.39 SV1.5 SV1.6 SV2.5
N$23
  Bottom 1.016: R21.1 86.36,30.48 85.09,31.75 R17.E
N$24
  Bottom 1.016: IC3.5 R20.2
N$25
  Bottom 1.016: IC4.2 R26.1 R23.2 52.07,21.59 31.75,21.59 28.02,17.86 R40.1A
N$26
  Bottom 1.016: SL2.1 171.45,40.64 R8.2
  Bottom 1.422: R60.2 R61.1 172.72,54.61 R50.1 R31.2 R8.2
N$27
  Bottom 1.016: IC4.1 R28.2
N$28
  Bottom 1.016: R24.A R27.1
N$29
  Bottom 1.016: R39.1S R39.1E 63.42,20.24 72.39,29.21 SL4.2 R22.1
N$30  (via drill 1 pad 2.18)
  Top 1.676: v30.48,60.96 v30.48,45.72
  Bottom 1.016: R26.2 60.96,30.48 59.69,31.75 IC4.3
  Bottom 1.422: IC4.3 57.15,35.56 50.8,35.56 40.64,26.67 24.13,26.67 16.51,34.29 X8.1 15.24,38.1 17.78,40.64 SL8.3 20.32,44.45 21.59,45.72 v30.48,45.72 | v30.48,60.96 33.02,63.5 SV1.7 SV1.8 SV2.7
N$31
  Bottom 1.016: R28.1 35.56,30.48 34.29,31.75 R24.E
N$32
  Bottom 1.016: R27.2 IC4.5
N$33
  Bottom 1.016: R18.1E R18.1S 170.18,26.67 171.45,27.94 SL2.2 R8.1
N$34
  Bottom 1.016: R25.1S R25.1E R18.1A
N$35
  Bottom 1.016: R38.1S R38.1E R37.1A
N$36
  Bottom 1.422: R30.2 232.41,40.64 226.06,46.99 R29.1
N$37
  Bottom 1.422: R31.1 180.34,49.53 180.34,82.55 189.23,91.44 224.79,91.44 227.33,88.9 227.33,71.12 232.41,66.04 R32.2
N$38
  Bottom 1.422: R35.1 81.28,48.26 88.9,55.88 88.9,86.36 93.98,91.44 134.62,91.44 144.78,101.6 229.87,101.6 R36.2
N$39
  Bottom 1.422: R36.1 237.49,99.06 234.95,101.6 X4.1 242.57,110.49 245.11,113.03 R84.1
N$40
  Bottom 1.016: R40.1S R40.1E R39.1A
N$41
  Bottom 1.016: R56.1 202.18,75.18 T5.E Q1.B 191.52,68.83 R54.2 198.12,62.23 R59.A
N$42
  Bottom 1.422: R43.1 R44.1 SL6.1 SL6.2
N$43
  Bottom 1.422: SL7.2 SL7.1 R45.1 R46.1
N$44
  Bottom 1.016: SL8.2 SL8.1
  Bottom 1.422: SL8.1 R47.1 R48.1
N$45
  Bottom 1.016: IC2.6 R50.2 R65.2 R63.1
N$46
  Bottom 1.016: SL1.1 218.44,40.64 R1.2
  Bottom 1.422: R57.2 R58.1 219.71,54.61 R49.1 R29.2 R1.2
N$47
  Bottom 1.422: SL5.2 SL5.1 R41.1 R42.1
N$48
  Bottom 1.016: IC3.6 R51.2 R71.2 R72.1
N$49
  Bottom 1.016: T1.B 219.46,85.34 218.44,86.36 205.74,86.36 204.47,85.09 T5.C R55.1 198.12,68.58 R53.1 205.74,66.04 R59.E
N$50
  Bottom 1.016: IC4.6 R52.2 R79.2 R78.1
N$51
  Bottom 1.422: T1.E 214.88,71.37 R57.1
N$52
  Bottom 1.422: Q1.E 186.94,85.34 190.5,88.9 219.71,88.9 222.25,86.36 222.25,81.28 219.71,78.74 R58.2
N$53
  Bottom 1.016: T5.B 206.76,72.64 R59.S
N$54
  Bottom 1.422: T3.E 119.63,71.37 R67.1
N$55
  Bottom 1.422: Q2.E 139.95,85.34 143.51,88.9 172.72,88.9 175.26,86.36 175.26,73.66 R61.2
N$56
  Bottom 1.422: Q3.E 91.69,85.34 95.25,88.9 124.46,88.9 127,86.36 127,73.66 R68.2
N$57
  Bottom 1.422: T2.E 167.89,71.37 R60.1
N$58
  Bottom 1.016: R62.1 155.19,75.18 T6.E Q2.B 144.53,68.83 R63.2 151.13,62.23 R66.A
N$59
  Bottom 1.016: T2.B 172.47,85.34 171.45,86.36 158.75,86.36 157.48,85.09 T6.C R64.1 151.13,68.58 R65.1 158.75,66.04 R66.E
N$60
  Bottom 1.016: T6.B 159.77,72.64 R66.S
N$61
  Bottom 1.016: T3.B 124.21,85.34 123.19,86.36 110.49,86.36 109.22,85.09 T7.C R69.1 102.87,68.58 R71.1 110.49,66.04 R73.E
N$62
  Bottom 1.016: R70.1 106.93,75.18 T7.E Q3.B 96.27,68.83 R72.2 102.87,62.23 R73.A
N$63
  Bottom 1.422: T4.E 70.1,72.64 R74.1
N$64
  Bottom 1.422: R75.2 78.74,76.2 78.74,86.36 76.2,88.9 45.72,88.9 42.16,85.34 Q4.E
N$65
  Bottom 1.016: T7.B 111.51,72.64 R73.S
N$66
  Bottom 1.422: R81.1 245.11,36.83 242.57,34.29 X1.1 234.95,25.4 237.49,22.86 R30.1
N$67
  Bottom 1.422: R82.1 245.11,62.23 242.57,59.69 X2.1 234.95,50.8 237.49,48.26 R32.1
N$68
  Bottom 1.016: T4.B 74.68,85.34 73.66,86.36 60.96,86.36 59.69,85.09 T8.C R76.1 53.34,68.58 R79.1 60.96,66.04 R80.E
N$69
  Bottom 1.016: R77.1 57.4,75.18 T8.E Q4.B 46.74,67.56 R78.2 52.07,62.23 R80.A
N$70
  Bottom 1.016: T8.B 61.98,72.64 R80.S
N$72
  Bottom 1.422: R33.1 133.35,50.8 133.35,82.55 147.32,96.52 227.33,96.52 232.41,91.44 R34.2
N$73
  Bottom 1.422: R83.1 245.11,87.63 242.57,85.09 X3.1 234.95,76.2 237.49,73.66 R34.1
VDD
  Top 1.676: T1.C 217.17,86.36 208.28,95.25 C20.1 | C18.1 113.03,95.25 121.92,86.36 T3.C | T4.C 72.39,87.63 63.5,96.52 C17.1 | T2.C 170.18,86.36 161.29,95.25 C19.1
  Bottom 1.016: T1.C R55.2 217.17,64.77 210.82,58.42 210.82,50.8 C8.1 210.82,45.72 210.82,39.37 209.55,38.1 205.74,38.1 IC1.7 | T2.C R64.2 170.18,64.77 163.83,58.42 163.83,50.8 C5.1 163.83,45.72 163.83,39.37 162.56,38.1 158.75,38.1 IC2.7 | T3.C R69.2 121.92,64.77 115.57,58.42 115.57,50.8 C3.1 115.57,45.72 115.57,39.37 114.3,38.1 110.49,38.1 IC3.7 | IC4.7 59.69,38.1 63.5,38.1 64.77,39.37 64.77,45.72 C1.1 64.77,50.8 64.77,58.42 72.39,66.04 R76.2 T4.C
  Bottom 1.676: C10.+ 173.99,113.03 215.9,113.03 C9.+ | C13.+ C18.1 | C13.+ 125.73,113.03 168.91,113.03 C10.+ | C13.+ 120.65,113.03 76.2,113.03 C14.+ C17.1 | PAD1.1 214.63,124.46 222.25,116.84 222.25,111.76 220.98,110.49 C9.+ | C19.1 C10.+ | C20.1 C9.+
VSS
  Top 1.676: Q1.C 189.23,86.36 198.12,95.25 C24.2 | Q2.C 142.24,86.36 151.13,95.25 C23.2 | Q3.C 93.98,86.36 102.87,95.25 C22.2 | C21.2 53.34,96.52 44.45,87.63 Q4.C
  Bottom 1.016: Q1.C R56.2 189.23,68.58 182.88,62.23 R3.S 187.96,33.02 191.77,36.83 C7.2 196.85,40.64 201.93,35.56 205.74,35.56 IC1.4 | Q2.C R62.2 142.24,68.58 135.89,62.23 R10.S 140.97,33.02 144.78,36.83 C6.2 149.86,40.64 154.94,35.56 158.75,35.56 IC2.4 | Q3.C R70.2 91.44,72.39 91.44,53.34 87.63,49.53 R17.S 92.71,33.02 96.52,36.83 C4.2 100.33,40.64 102.87,38.1 107.95,38.1 IC3.4 | Q4.C R77.2 40.64,71.12 40.64,52.07 36.83,48.26 R24.S 41.91,33.02 45.72,36.83 C2.2 49.53,40.64 52.07,38.1 57.15,38.1 IC4.4
  Bottom 1.676: C11.- 185.42,107.95 143.51,107.95 C12.- | C12.- 138.43,107.95 95.25,107.95 C15.- | C15.- 90.17,107.95 45.72,107.95 C16.- C21.2 | PAD3.1 181.61,128.27 214.63,128.27 224.79,118.11 224.79,109.22 223.52,107.95 190.5,107.95 C11.- | C22.2 C15.- | C12.- C23.2 | C24.2 C11.-